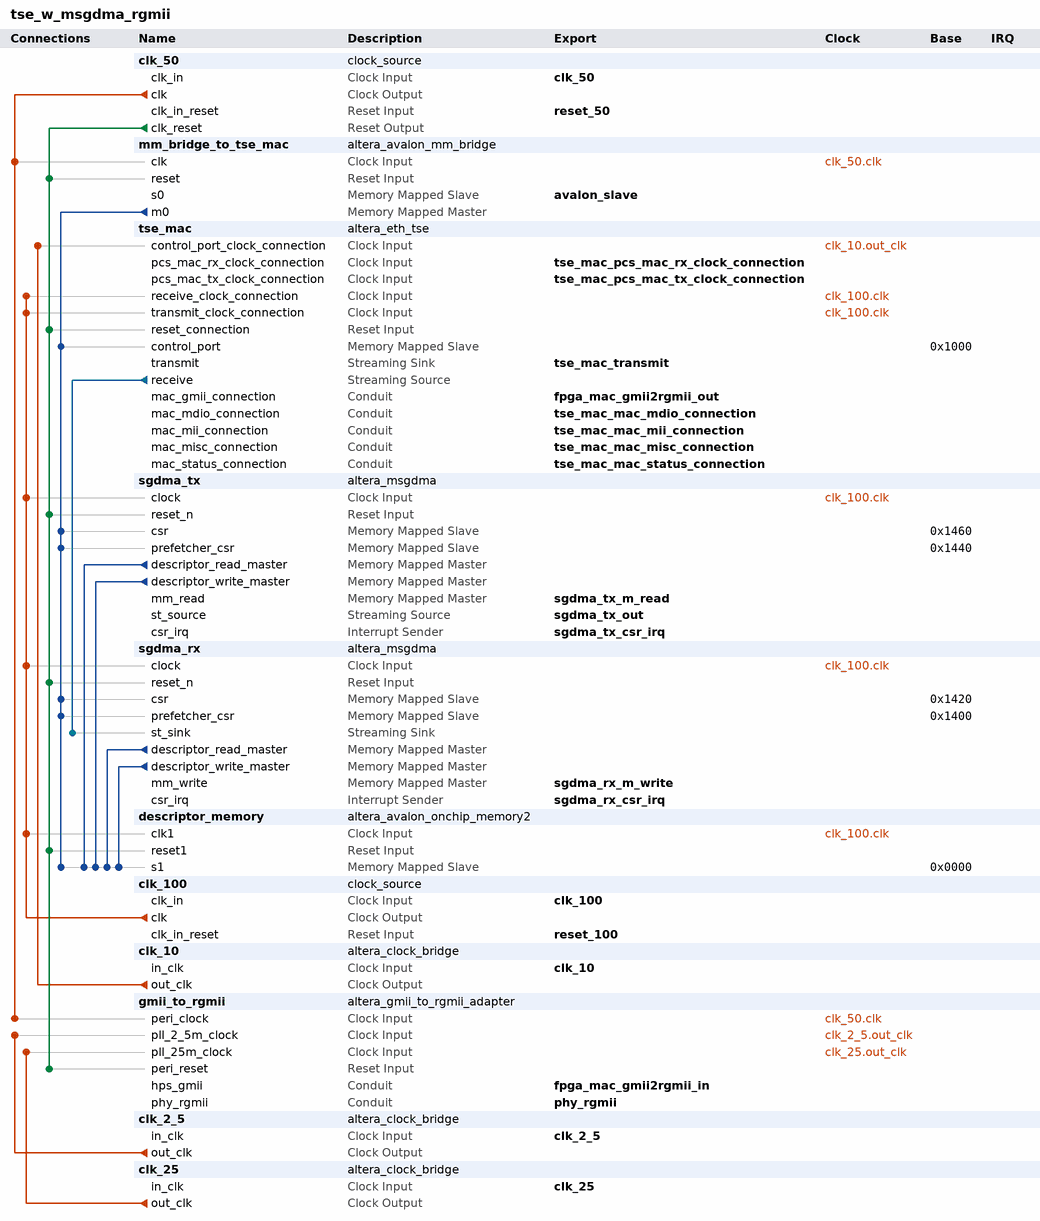
[diagram p0: system contents]
# Platform Designer (Qsys) system tse_w_msgdma_rgmii, Arria 10 10AS066H2F34I1SG
# Parameters at their usual value, and those the tool derives, are not listed.
package require -exact qsys 18.1
create_system tse_w_msgdma_rgmii
set_project_property DEVICE_FAMILY {Arria 10}
set_project_property DEVICE 10AS066H2F34I1SG

add_instance clk_50 clock_source 18.1
set_instance_parameter_value clk_50 clockFrequency 50000000
set_instance_parameter_value clk_50 resetSynchronousEdges BOTH

add_instance mm_bridge_to_tse_mac altera_avalon_mm_bridge 18.1
set_instance_parameter_value mm_bridge_to_tse_mac ADDRESS_UNITS SYMBOLS
set_instance_parameter_value mm_bridge_to_tse_mac ADDRESS_WIDTH 13
set_instance_parameter_value mm_bridge_to_tse_mac DATA_WIDTH 32
set_instance_parameter_value mm_bridge_to_tse_mac MAX_BURST_SIZE 8
set_instance_parameter_value mm_bridge_to_tse_mac MAX_PENDING_RESPONSES 4
set_instance_parameter_value mm_bridge_to_tse_mac USE_AUTO_ADDRESS_WIDTH 0

add_instance tse_mac altera_eth_tse 18.1
set_instance_parameter_value tse_mac XCVR_RCFG_JTAG_ENABLE 0
set_instance_parameter_value tse_mac XCVR_SET_CAPABILITY_REG_ENABLE 0
set_instance_parameter_value tse_mac XCVR_SET_CSR_SOFT_LOGIC_ENABLE 0
set_instance_parameter_value tse_mac XCVR_SET_PRBS_SOFT_LOGIC_ENABLE 0
set_instance_parameter_value tse_mac XCVR_SET_USER_IDENTIFIER 0
set_instance_parameter_value tse_mac core_variation MAC_ONLY
set_instance_parameter_value tse_mac eg_addr 12
set_instance_parameter_value tse_mac enable_hd_logic true
set_instance_parameter_value tse_mac enable_mac_flow_ctrl true
set_instance_parameter_value tse_mac enable_magic_detect false
set_instance_parameter_value tse_mac enable_sgmii true
set_instance_parameter_value tse_mac enable_shift16 true
set_instance_parameter_value tse_mac ifGMII MII_GMII
set_instance_parameter_value tse_mac ing_addr 12
set_instance_parameter_value tse_mac mdio_clk_div 200
set_instance_parameter_value tse_mac phyip_pma_bonding_mode xN
set_instance_parameter_value tse_mac stat_cnt_ena true
set_instance_parameter_value tse_mac transceiver_type NONE

add_instance sgdma_tx altera_msgdma 18.1
set_instance_parameter_value sgdma_tx BURST_ENABLE 0
set_instance_parameter_value sgdma_tx DATA_FIFO_DEPTH 128
set_instance_parameter_value sgdma_tx DATA_WIDTH 32
set_instance_parameter_value sgdma_tx DESCRIPTOR_FIFO_DEPTH 128
set_instance_parameter_value sgdma_tx ENHANCED_FEATURES 0
set_instance_parameter_value sgdma_tx ERROR_ENABLE 1
set_instance_parameter_value sgdma_tx ERROR_WIDTH 1
set_instance_parameter_value sgdma_tx MAX_BURST_COUNT 2
set_instance_parameter_value sgdma_tx MAX_BYTE 262144
set_instance_parameter_value sgdma_tx MODE 1
set_instance_parameter_value sgdma_tx PACKET_ENABLE 1
set_instance_parameter_value sgdma_tx PREFETCHER_ENABLE 1
set_instance_parameter_value sgdma_tx TRANSFER_TYPE {Aligned Accesses}

add_instance sgdma_rx altera_msgdma 18.1
set_instance_parameter_value sgdma_rx BURST_ENABLE 0
set_instance_parameter_value sgdma_rx DATA_FIFO_DEPTH 64
set_instance_parameter_value sgdma_rx DATA_WIDTH 32
set_instance_parameter_value sgdma_rx DESCRIPTOR_FIFO_DEPTH 128
set_instance_parameter_value sgdma_rx ENHANCED_FEATURES 0
set_instance_parameter_value sgdma_rx ERROR_ENABLE 1
set_instance_parameter_value sgdma_rx ERROR_WIDTH 6
set_instance_parameter_value sgdma_rx MAX_BURST_COUNT 2
set_instance_parameter_value sgdma_rx MAX_BYTE 262144
set_instance_parameter_value sgdma_rx MODE 2
set_instance_parameter_value sgdma_rx PACKET_ENABLE 1
set_instance_parameter_value sgdma_rx PREFETCHER_ENABLE 1
set_instance_parameter_value sgdma_rx TRANSFER_TYPE {Aligned Accesses}

add_instance descriptor_memory altera_avalon_onchip_memory2 18.1
set_instance_parameter_value descriptor_memory dataWidth 32
set_instance_parameter_value descriptor_memory dualPort false
set_instance_parameter_value descriptor_memory initMemContent true
set_instance_parameter_value descriptor_memory initializationFileName descriptor_memory
set_instance_parameter_value descriptor_memory memorySize 4096

add_instance clk_100 clock_source 18.1
set_instance_parameter_value clk_100 clockFrequency 100000000
set_instance_parameter_value clk_100 resetSynchronousEdges BOTH

add_instance clk_10 altera_clock_bridge 18.1
set_instance_parameter_value clk_10 DERIVED_CLOCK_RATE 0
set_instance_parameter_value clk_10 EXPLICIT_CLOCK_RATE 10000000

add_instance gmii_to_rgmii altera_gmii_to_rgmii_adapter 18.1
set_instance_parameter_value gmii_to_rgmii RX_PIPELINE_DEPTH 2
set_instance_parameter_value gmii_to_rgmii TX_PIPELINE_DEPTH 2

add_instance clk_2_5 altera_clock_bridge 18.1
set_instance_parameter_value clk_2_5 DERIVED_CLOCK_RATE 0
set_instance_parameter_value clk_2_5 EXPLICIT_CLOCK_RATE 2500000

add_instance clk_25 altera_clock_bridge 18.1
set_instance_parameter_value clk_25 DERIVED_CLOCK_RATE 0
set_instance_parameter_value clk_25 EXPLICIT_CLOCK_RATE 25000000

# connections
add_connection clk_2_5.out_clk gmii_to_rgmii.pll_2_5m_clock clock
add_connection clk_10.out_clk tse_mac.control_port_clock_connection clock
add_connection clk_25.out_clk gmii_to_rgmii.pll_25m_clock clock
add_connection clk_50.clk gmii_to_rgmii.peri_clock clock
add_connection clk_50.clk mm_bridge_to_tse_mac.clk clock
add_connection clk_100.clk descriptor_memory.clk1 clock
add_connection clk_100.clk sgdma_rx.clock clock
add_connection clk_100.clk sgdma_tx.clock clock
add_connection clk_100.clk tse_mac.receive_clock_connection clock
add_connection clk_100.clk tse_mac.transmit_clock_connection clock
add_connection clk_50.clk_reset descriptor_memory.reset1 reset
add_connection clk_50.clk_reset gmii_to_rgmii.peri_reset reset
add_connection clk_50.clk_reset mm_bridge_to_tse_mac.reset reset
add_connection clk_50.clk_reset sgdma_rx.reset_n reset
add_connection clk_50.clk_reset sgdma_tx.reset_n reset
add_connection clk_50.clk_reset tse_mac.reset_connection reset
add_connection mm_bridge_to_tse_mac.m0 descriptor_memory.s1 avalon
set_connection_parameter_value mm_bridge_to_tse_mac.m0/descriptor_memory.s1 baseAddress 0x0000
add_connection mm_bridge_to_tse_mac.m0 sgdma_rx.csr avalon
set_connection_parameter_value mm_bridge_to_tse_mac.m0/sgdma_rx.csr baseAddress 0x1420
add_connection mm_bridge_to_tse_mac.m0 sgdma_rx.prefetcher_csr avalon
set_connection_parameter_value mm_bridge_to_tse_mac.m0/sgdma_rx.prefetcher_csr baseAddress 0x1400
add_connection mm_bridge_to_tse_mac.m0 sgdma_tx.csr avalon
set_connection_parameter_value mm_bridge_to_tse_mac.m0/sgdma_tx.csr baseAddress 0x1460
add_connection mm_bridge_to_tse_mac.m0 sgdma_tx.prefetcher_csr avalon
set_connection_parameter_value mm_bridge_to_tse_mac.m0/sgdma_tx.prefetcher_csr baseAddress 0x1440
add_connection mm_bridge_to_tse_mac.m0 tse_mac.control_port avalon
set_connection_parameter_value mm_bridge_to_tse_mac.m0/tse_mac.control_port baseAddress 0x1000
add_connection sgdma_rx.descriptor_read_master descriptor_memory.s1 avalon
set_connection_parameter_value sgdma_rx.descriptor_read_master/descriptor_memory.s1 baseAddress 0x0000
add_connection sgdma_rx.descriptor_write_master descriptor_memory.s1 avalon
set_connection_parameter_value sgdma_rx.descriptor_write_master/descriptor_memory.s1 baseAddress 0x0000
add_connection sgdma_tx.descriptor_read_master descriptor_memory.s1 avalon
set_connection_parameter_value sgdma_tx.descriptor_read_master/descriptor_memory.s1 baseAddress 0x0000
add_connection sgdma_tx.descriptor_write_master descriptor_memory.s1 avalon
set_connection_parameter_value sgdma_tx.descriptor_write_master/descriptor_memory.s1 baseAddress 0x0000
add_connection tse_mac.receive sgdma_rx.st_sink avalon_streaming

# exported interfaces
add_interface avalon_slave avalon slave
set_interface_property avalon_slave EXPORT_OF mm_bridge_to_tse_mac.s0
add_interface clk_10 clock sink
set_interface_property clk_10 EXPORT_OF clk_10.in_clk
add_interface clk_100 clock sink
set_interface_property clk_100 EXPORT_OF clk_100.clk_in
add_interface clk_25 clock sink
set_interface_property clk_25 EXPORT_OF clk_25.in_clk
add_interface clk_2_5 clock sink
set_interface_property clk_2_5 EXPORT_OF clk_2_5.in_clk
add_interface clk_50 clock sink
set_interface_property clk_50 EXPORT_OF clk_50.clk_in
add_interface fpga_mac_gmii2rgmii_in conduit end
set_interface_property fpga_mac_gmii2rgmii_in EXPORT_OF gmii_to_rgmii.hps_gmii
add_interface fpga_mac_gmii2rgmii_out conduit end
set_interface_property fpga_mac_gmii2rgmii_out EXPORT_OF tse_mac.mac_gmii_connection
add_interface phy_rgmii conduit end
set_interface_property phy_rgmii EXPORT_OF gmii_to_rgmii.phy_rgmii
add_interface reset_100 reset sink
set_interface_property reset_100 EXPORT_OF clk_100.clk_in_reset
add_interface reset_50 reset sink
set_interface_property reset_50 EXPORT_OF clk_50.clk_in_reset
add_interface sgdma_rx_csr_irq interrupt sender
set_interface_property sgdma_rx_csr_irq EXPORT_OF sgdma_rx.csr_irq
add_interface sgdma_rx_m_write avalon master
set_interface_property sgdma_rx_m_write EXPORT_OF sgdma_rx.mm_write
add_interface sgdma_tx_csr_irq interrupt sender
set_interface_property sgdma_tx_csr_irq EXPORT_OF sgdma_tx.csr_irq
add_interface sgdma_tx_m_read avalon master
set_interface_property sgdma_tx_m_read EXPORT_OF sgdma_tx.mm_read
add_interface sgdma_tx_out avalon_streaming source
set_interface_property sgdma_tx_out EXPORT_OF sgdma_tx.st_source
add_interface tse_mac_mac_mdio_connection conduit end
set_interface_property tse_mac_mac_mdio_connection EXPORT_OF tse_mac.mac_mdio_connection
add_interface tse_mac_mac_mii_connection conduit end
set_interface_property tse_mac_mac_mii_connection EXPORT_OF tse_mac.mac_mii_connection
add_interface tse_mac_mac_misc_connection conduit end
set_interface_property tse_mac_mac_misc_connection EXPORT_OF tse_mac.mac_misc_connection
add_interface tse_mac_mac_status_connection conduit end
set_interface_property tse_mac_mac_status_connection EXPORT_OF tse_mac.mac_status_connection
add_interface tse_mac_pcs_mac_rx_clock_connection clock sink
set_interface_property tse_mac_pcs_mac_rx_clock_connection EXPORT_OF tse_mac.pcs_mac_rx_clock_connection
add_interface tse_mac_pcs_mac_tx_clock_connection clock sink
set_interface_property tse_mac_pcs_mac_tx_clock_connection EXPORT_OF tse_mac.pcs_mac_tx_clock_connection
add_interface tse_mac_transmit avalon_streaming sink
set_interface_property tse_mac_transmit EXPORT_OF tse_mac.transmit

set_interconnect_requirement {$system} qsys_mm.clockCrossingAdapter AUTO
set_interconnect_requirement {$system} qsys_mm.maxAdditionalLatency 2

save_system tse_w_msgdma_rgmii.qsys
